# EasyEDA Pro project Quadcopter_v1.epro, schematic Quadcopter2.4
Board Name: Quadcopter2.4; Create Date: 2024-12-10; Page Name: P1; Project Name: Quadcopter; Schematic Name: Quadcopter2.4; Update Date: 2024-12-10; Address1: *; Address2: *; Address3: *; Address4: *; Application_BuildNumber: *; ApprovedBy: *; Author: *; CheckedBy: *; CompanyName: *; CurrentDate: *; CurrentTime: *; Date: *; DocumentFullPathAndName: *; DocumentName: *; DocumentNumber: *; DrawnBy: *; Engineer: *; ImagePath: *; ModifiedDate: *; Organization: *; ProjectName: *; Revision: *; Rule: *; SheetNumber: 1; SheetTotal: 1; Time: *; Title: *
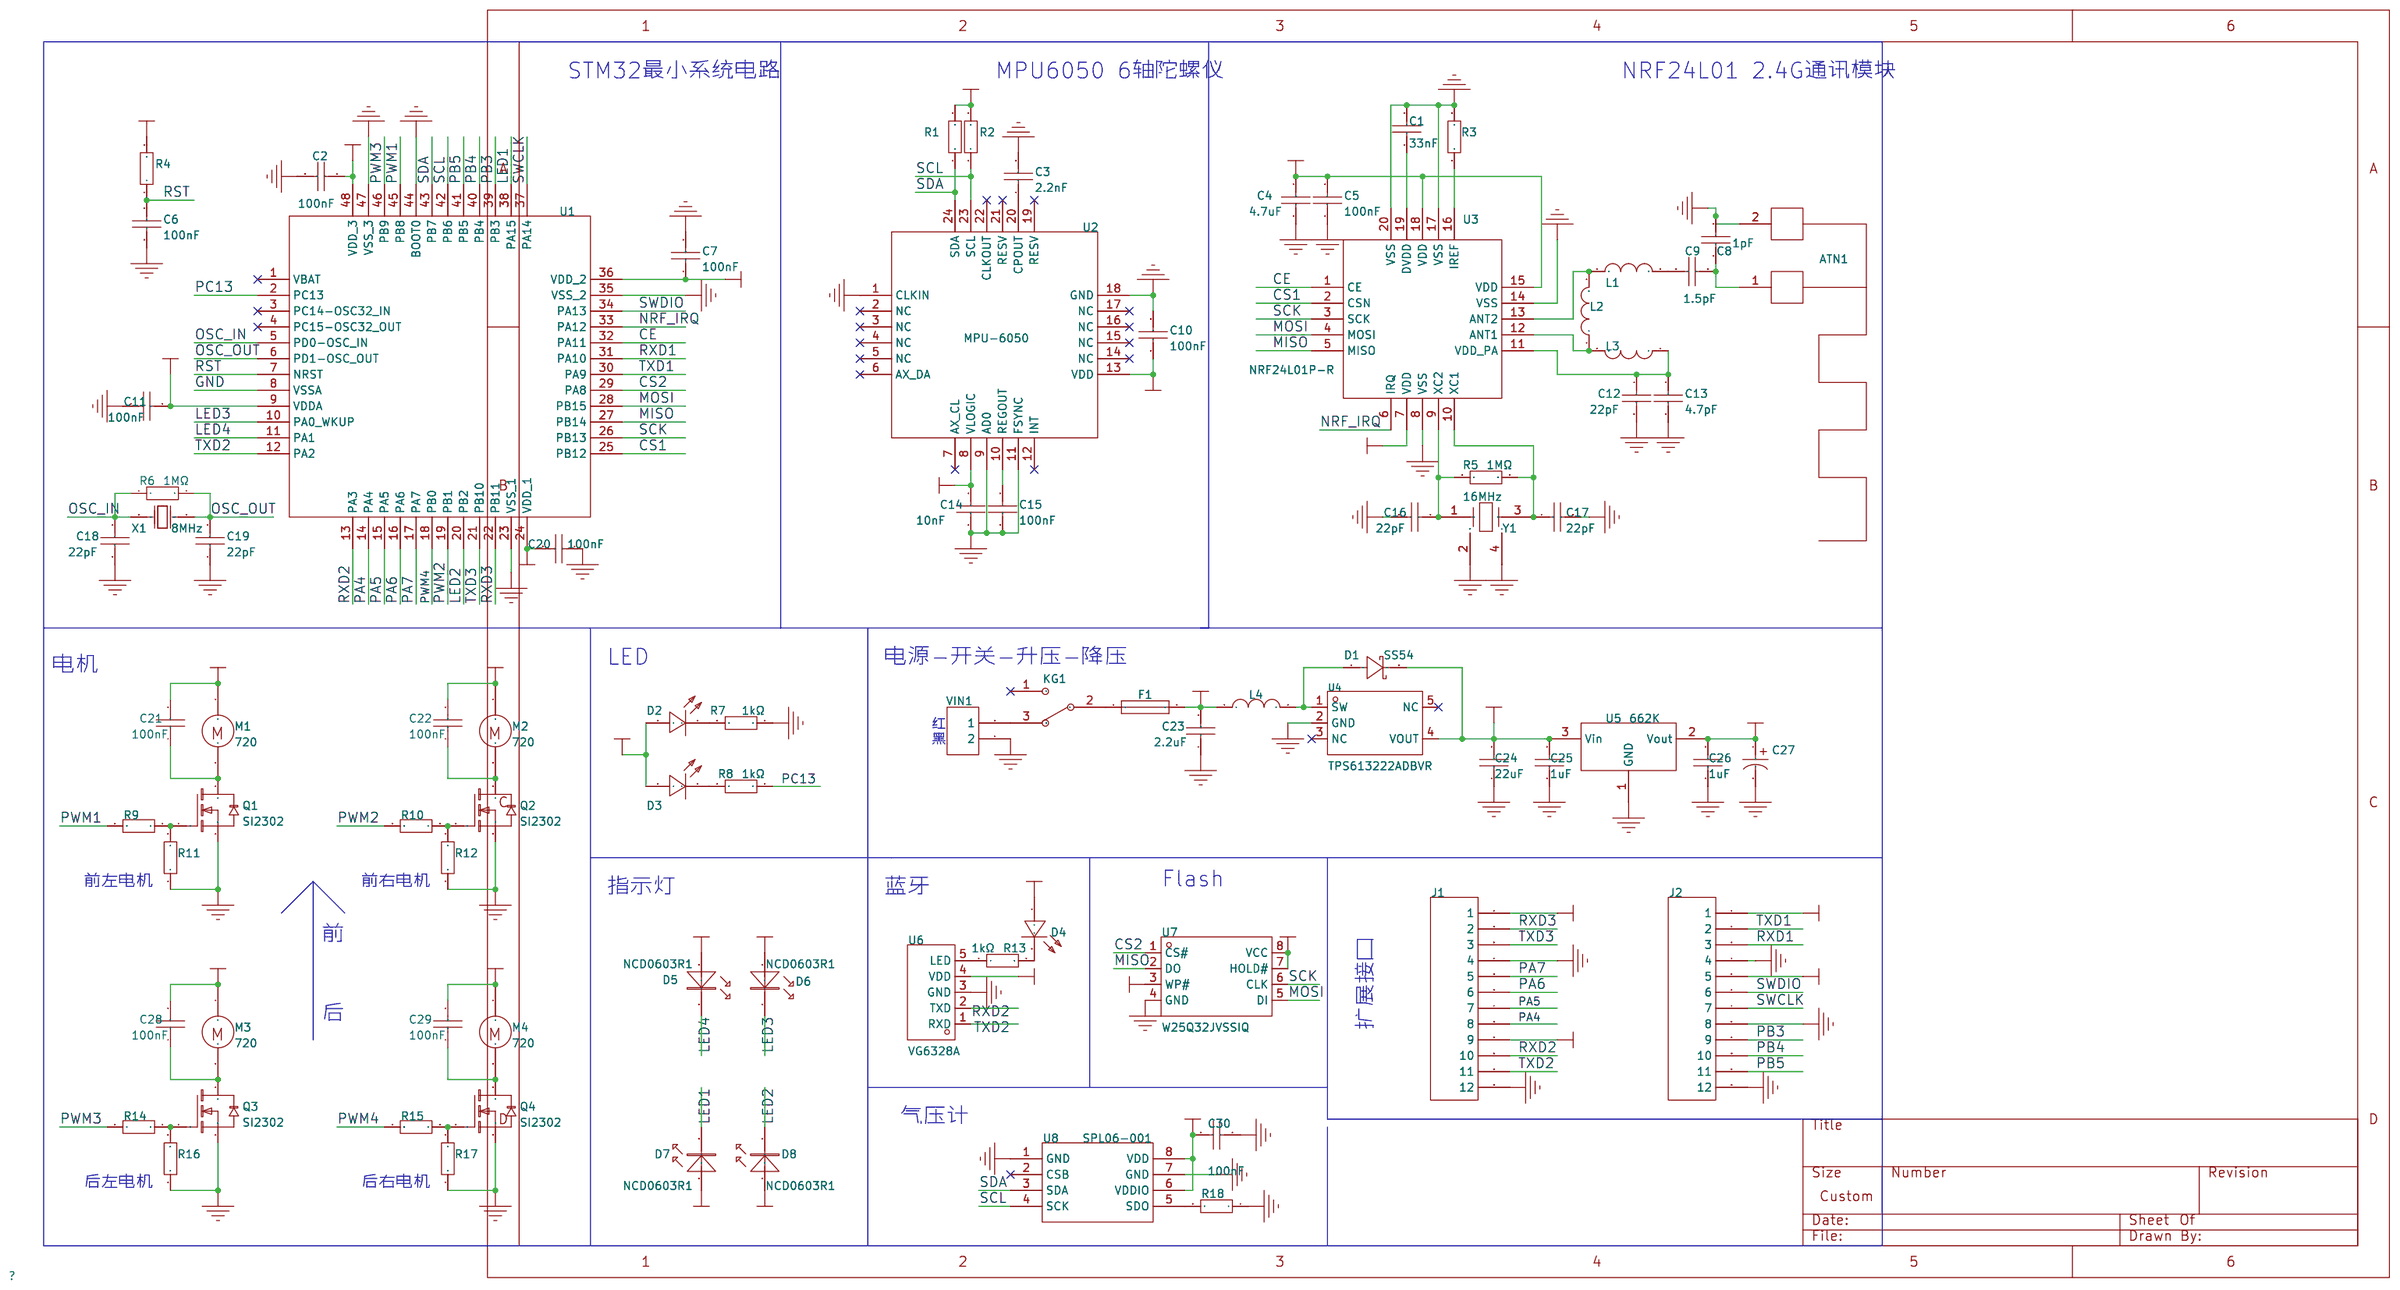
[diagram p0: schematic sheet]

## Parts
ATN1  ANT2.4G  [2.4G/ANT_2_1]
C1  33nF  [C0603]
C2  100nF  [C0603]
C3  2.2nF  [C0603]
C4  4.7uF  [C0603]
C5  100nF  [C0603]
C6  100nF  [C0603]
C7  100nF  [C0603]
C8  1pF  [C0603]
C9  1.5pF  [C0603]
C10  100nF  [C0603]
C11  100nF  [C0603]
C12  22pF  [C0603]
C13  4.7pF  [C0402]
C14  10nF  [C0603]
C15  100nF  [C0603]
C16  22pF  [C0603]
C17  22pF  [C0603]
C18  22pF  [C0603]
C19  22pF  [C0603]
C20  100nF  [C0603]
C21  100nF  [C0603]
C22  100nF  [C0603]
C23  2.2uF  [C0603]
C24  22uF  [C0603]
C25  1uF  [C0603]
C26  1uF  [C0603]
C27  47uF  [CAP-SMD_L3.2-W1.6-RD]
C28  100nF  [C0603]
C29  100nF  [C0603]
C30  100nF  [C0603]
D1  SS54  [SMA_L4.3-W2.6-LS5.0-FD]
D2  NCD0603G1  [LED0603-RD]
D3  NCD0603G1  [LED0603-RD]
D4  NCD0603G1  [LED0603-RD]
D5  NCD0603R1  [LED0603-RD_RED]
D6  NCD0603R1  [LED0603-RD_RED]
D7  NCD0603R1  [LED0603-RD_RED]
D8  NCD0603R1  [LED0603-RD_RED]
F1  BSMD0603-050-6V  [F0603]
J1  HB-PH3-254112PB2GOP  [HDR-TH_12P-P2.54-V-M]
J2  HB-PH3-254112PB2GOP  [HDR-TH_12P-P2.54-V-M]
KG1  MSK12C02  [SW-TH_MSK12C02]
L1  3.9nH  [L0603]
L2  8.2nH  [L0603]
L3  2.7nH  [L0603]
L4  2.2uH  [IND-SMD_L2.5-W2.0_MHCHL2520]
M1  720  [HDR2.54-LI-2P]
M2  720  [HDR2.54-LI-2P]
M3  720  [HDR2.54-LI-2P]
M4  720  [HDR2.54-LI-2P]
Q1  SI2302  [SOT-23-3_L2.9-W1.3-P1.90-LS2.4-BR]
Q2  SI2302  [SOT-23-3_L2.9-W1.3-P1.90-LS2.4-BR]
Q3  SI2302  [SOT-23-3_L2.9-W1.3-P1.90-LS2.4-BR]
Q4  SI2302  [SOT-23-3_L2.9-W1.3-P1.90-LS2.4-BR]
R1  10kΩ  [R0603]
R2  10kΩ  [R0603]
R3  22kΩ  [R0603]
R4  10kΩ  [R0603]
R5  1MΩ  [R0603]
R6  1MΩ  [R0603]
R7  1kΩ  [R0603]
R8  1kΩ  [R0603]
R9  1kΩ  [R0603]
R10  1kΩ  [R0603]
R11  10kΩ  [R0603]
R12  10kΩ  [R0603]
R13  1kΩ  [R0603]
R14  1kΩ  [R0603]
R15  1kΩ  [R0603]
R16  10kΩ  [R0603]
R17  10kΩ  [R0603]
R18  10kΩ  [R0603]
U1  STM32F103C8T6  [LQFP-48_L7.0-W7.0-P0.50-LS9.0-BL]
U2  MPU-6050  [QFN-24_L4.0-W4.0-P0.50-BL-EP2.7]
U3  NRF24L01P-R  [QFN-20_L4.0-W4.0-P0.50-BL-EP]
U4  TPS613222ADBVR  [TSOT-23-5_L2.9-W1.6-P0.95-LS2.8-BR]
U5  662K  [SOT-23-3_L2.9-W1.3-P1.90-LS2.4-BR]
U6  VG6328A  [COMM-SMD_VG6328A]
U7  W25Q32JVSSIQ  [SOIC-8_L5.3-W5.3-P1.27-LS8.0-BL]
U8  SPL06-001  [SENSOR-SMD_SPL06-001]
VIN1  PZ254R-11-02P  [HDR-TH_2P-P2.54-H-M-W10.4]
X1  8MHz  [CRYSTAL-SMD_L5.0-W3.2]
Y1  16MHz  [OSC-SMD_4P-L3.2-W2.5-BL]

## Library data of the parts
ATN1 = ANT2.4G: Design Item ID: ANT2.4G_2; Library Name: fly
C1 = CC0603KRX7R9BB333: 容值:33nF;精度:±10%;额定电压:50V;材质(温度系数):X7R;; LCSC Part Name: 33nF ±10% 50V; Supplier Part: C106856; Manufacturer: YAGEO(国巨); Supplier Footprint: 0603; JLCPCB Part Class: Extended Part; Datasheet: https://atta.szlcsc.com/upload/public/pdf/source/20170919/C131031_1505787245477976978.pdf; Supplier: LCSC; Tolerance: ±10%; Voltage Rated: 50V; Temperature Coefficient: X7R; Design Item ID: CAP; Library Name: fly
C2 C5-C7 C10 C11 C15 C20-C22 C28-C30 = CC0603KRX7R9BB104: 容值:100nF;精度:±10%;额定电压:50V;材质(温度系数):X7R;; LCSC Part Name: 100nF ±10% 50V; Supplier Part: C14663; Manufacturer: YAGEO(国巨); Supplier Footprint: 0603; JLCPCB Part Class: Basic Part; Datasheet: https://atta.szlcsc.com/upload/public/pdf/source/20180910/C282072_33301C7F631E79921B82A8DAC6BCC5B3.pdf; Supplier: LCSC; Tolerance: ±10%; Voltage Rated: 50V; Temperature Coefficient: X7R; Design Item ID: CAP; Library Name: fly
C3 = CC0603KRX7R9BB222: 容值:2.2nF;精度:±10%;额定电压:50V;材质(温度系数):X7R;; LCSC Part Name: 2.2nF ±10% 50V; Supplier Part: C107082; Manufacturer: YAGEO(国巨); Supplier Footprint: 0603; JLCPCB Part Class: Extended Part; Datasheet: https://atta.szlcsc.com/upload/public/pdf/source/20180910/C282072_33301C7F631E79921B82A8DAC6BCC5B3.pdf; Supplier: LCSC; Tolerance: ±10%; Voltage Rated: 50V; Temperature Coefficient: X7R; Design Item ID: CAP; Library Name: fly
C4 = CL10A475KP8NNNC: 容值:4.7uF;精度:±10%;额定电压:10V;材质(温度系数):X5R;; LCSC Part Name: 4.7uF ±10% 10V; Supplier Part: C1705; Manufacturer: SAMSUNG(三星); Supplier Footprint: 0603; JLCPCB Part Class: Extended Part; Datasheet: https://atta.szlcsc.com/upload/public/pdf/source/20160218/1457707763339.pdf; Supplier: LCSC; Tolerance: ±10%; Voltage Rated: 10V; Temperature Coefficient: X5R; Design Item ID: CAP; Library Name: fly
C8 = CC0603BRNPO9BN1R0: 容值:1pF;额定电压:50V;材质(温度系数):NP0;; LCSC Part Name: 1pF 50V; Supplier Part: C115062; Manufacturer: YAGEO(国巨); Supplier Footprint: 0603; JLCPCB Part Class: Extended Part; Datasheet: https://atta.szlcsc.com/upload/public/pdf/source/20200715/C115062_568EBB839DD5FCCCFFFD9B399C98B320.pdf; Supplier: LCSC; Voltage Rated: 50V; Temperature Coefficient: NP0; Design Item ID: CAP; Library Name: fly
C9 = CC0603BRNPO9BN1R5: 容值:1.5pF;额定电压:50V;材质(温度系数):NP0;; LCSC Part Name: 1.5pF 50V; Supplier Part: C519100; Manufacturer: YAGEO(国巨); Supplier Footprint: 0603; JLCPCB Part Class: Extended Part; Datasheet: https://atta.szlcsc.com/upload/public/pdf/source/20200423/C519100_590EDC9A5984E9A1EB7B6CD778FC3C5B.pdf; Supplier: LCSC; Voltage Rated: 50V; Temperature Coefficient: NP0; Tolerance: ±5%; Design Item ID: CAP; Library Name: fly
C12 C16-C19 = CC0603JRNPO9BN220: 容值:22pF;精度:±5%;额定电压:50V;材质(温度系数):NP0;; LCSC Part Name: 22pF ±5% 50V; Supplier Part: C105620; Manufacturer: YAGEO(国巨); Supplier Footprint: 0603; JLCPCB Part Class: Extended Part; Datasheet: https://atta.szlcsc.com/upload/public/pdf/source/20170505/1493957838062.pdf; Supplier: LCSC; Tolerance: ±5%; Voltage Rated: 50V; Temperature Coefficient: NP0; Design Item ID: CAP; Library Name: fly
C13 = CC0402BRNPO9BN4R7: 容值:4.7pF;额定电压:50V;材质(温度系数):NP0;; LCSC Part Name: 4.7pF 50V; Supplier Part: C325453; Manufacturer: YAGEO(国巨); Supplier Footprint: 0402; JLCPCB Part Class: Extended Part; Datasheet: https://atta.szlcsc.com/upload/public/pdf/source/20181031/C325453_FE7FAD6962257328986AFAE1D40136CC.pdf; Supplier: LCSC; Voltage Rated: 50V; Temperature Coefficient: NP0; Tolerance: ±10%; Design Item ID: CAP; Library Name: fly
C14 = CC0603KRX7R9BB103: 容值:10nF;精度:±10%;额定电压:50V;材质(温度系数):X7R;; LCSC Part Name: 10nF ±10% 50V; Supplier Part: C100042; Manufacturer: YAGEO(国巨); Supplier Footprint: 0603; JLCPCB Part Class: Extended Part; Datasheet: https://atta.szlcsc.com/upload/public/pdf/source/20181008/C309510_22F155564471FAF6A489F7D68F34234E.pdf; Supplier: LCSC; Tolerance: ±10%; Voltage Rated: 50V; Temperature Coefficient: X7R; Design Item ID: CAP; Library Name: fly
C23 = CL10A225KO8NNNC: 容值:2.2uF;精度:±10%;额定电压:16V;材质(温度系数):X5R;; LCSC Part Name: 2.2uF ±10% 16V; Supplier Part: C23630; Manufacturer: SAMSUNG(三星); Supplier Footprint: 0603; JLCPCB Part Class: Basic Part; Datasheet: https://atta.szlcsc.com/upload/public/pdf/source/20160218/1457707763339.pdf; Supplier: LCSC; Tolerance: ±10%; Voltage Rated: 16V; Temperature Coefficient: X5R; Design Item ID: CAP; Library Name: fly
C24 = CL10A226MQ8NRNC: 容值:22uF;精度:±20%;额定电压:6.3V;材质(温度系数):X5R;; LCSC Part Name: 22uF ±20% 6.3V; Supplier Part: C59461; Manufacturer: SAMSUNG(三星); Supplier Footprint: 0603; JLCPCB Part Class: Basic Part; Datasheet: https://atta.szlcsc.com/upload/public/pdf/source/20160218/1457707763339.pdf; Supplier: LCSC; Tolerance: ±20%; Voltage Rated: 6.3V; Temperature Coefficient: X5R; Design Item ID: CAP; Library Name: fly
C25 C26 = CL10A105KO8NNNC: 容值:1uF;精度:±10%;额定电压:16V;材质(温度系数):X5R;; LCSC Part Name: 1uF ±10% 16V; Supplier Part: C1592; Manufacturer: SAMSUNG(三星); Supplier Footprint: 0603; JLCPCB Part Class: Extended Part; Datasheet: https://atta.szlcsc.com/upload/public/pdf/source/20220919/9FBE606BE0D9532D730F292EB26DC5BB.pdf; Supplier: LCSC; Tolerance: ±10%; Voltage Rated: 16V; Temperature Coefficient: X5R; Design Item ID: CAP; Library Name: fly
C27 = TC212A476K006Y: 容值:47uF;精度:±10%;额定电压:6.3V;等效串联电阻:2.5Ω@100kHz;; LCSC Part Name: 47uF ±10% 6.3V; Supplier Part: C108525; Manufacturer: Sunlord(顺络); Supplier Footprint: CASE-A-3216-18(mm); JLCPCB Part Class: Extended Part; Datasheet: https://atta.szlcsc.com/upload/public/pdf/source/20231030/DDA5D10C6B7FCAF98AC7C23C2BD0B0CB.pdf; Supplier: LCSC; Tolerance: ±10%; Rated Voltage: 6.3V; Equivalent Series Resistance(ESR): 2.5Ω@100kHz; Operating Temperature: -55℃~+125℃; Voltage Rated: 6.3V; Temperature Coefficient: X5R; Design Item ID: Cap Pol; Library Name: fly; Published: 8-Jun-2000; LatestRevisionDate: 17-Jul-2002; LatestRevisionNote: Re-released for DXP Platform.; PackageReference: RB7.6-15; Publisher: Altium Limited; PackageDescription: Polarized Capacitor (Radial); 2 Leads
D1 = SS54_C7420369: 二极管配置:独立式;正向压降(Vf):550mV@5.0A;直流反向耐压(Vr):40V;平均整流电流(Io):5A;; LCSC Part Name: 电压:40V 电流:5A; Supplier Part: C7420369; Manufacturer: 宏迦橙; Supplier Footprint: SMA(DO-214AC); JLCPCB Part Class: 扩展库; Datasheet: https://atta.szlcsc.com/upload/public/pdf/source/20230828/254C3882F8647358AD9F60DD73611B5E.pdf; Supplier: LCSC; Diode Configuration: 独立式; Forward Voltage (Vf@If): 550mV@5.0A; Reverse Voltage (Vr): 40V; Average Rectified Current (Io): 5A; Reverse Leakage Current (Ir): 50uA@40V; Peak forward surge current: 120A
D2-D4 = NCD0603G1: 发光颜色:翠绿色;正向电压(VF):2.6V~3.6V;功率:72mW;正向电流:10mA;主波长:515nm~530nm;透镜颜色:无色透明透镜;发光强度:330mcd~900mcd;发光角度:130°;工作温度:-30℃~+85℃;; Supplier Part: C84267; Manufacturer: 国星光电; Supplier Footprint: 0603; JLCPCB Part Class: Extended Part; Datasheet: https://atta.szlcsc.com/upload/public/pdf/source/20200820/C84267_04BA7703640BAC111D09F5EFB971FBF3.pdf; Supplier: LCSC; Emitted Color: 翠绿色; Forward Voltage (VF): 2.6V~3.6V; Power Dissipation: 72mW; Forward Current: 10mA; Dominant Wavelength: 515nm~530nm; Lens Color: 无色透明透镜; Luminous Intensity: 330mcd~900mcd; Viewing Angle: 130°; Operating Temperature: -30℃~+85℃; Diode Configuration: 独立二极管; Origin Footprint 1: 204-10SURD/S530-A3; Origin Footprint 2: LED0805-RD
D5-D8 = NCD0603R1_C84263: 灯头类型:-;发光颜色:红色;正向电压(VF):1.6V~2.6V;功率:65mW;正向电流:20mA;主波长:615nm~630nm;二极管配置:独立二极管;透镜颜色:无色透明透镜;色温:-;发光强度:80mcd~220mcd;发光角度:130°;载带方式:-;工作温度:-30℃~+85℃;; Supplier Part: C84263; Manufacturer: 国星光电; Supplier Footprint: 0603; JLCPCB Part Class: Extended Part; Datasheet: https://atta.szlcsc.com/upload/public/pdf/source/20200820/C84263_DABC6A75E58F576973B407FDBA283D60.pdf; Supplier: LCSC; Emitted Color: 红色; Forward Voltage (VF): 1.6V~2.6V; Power Dissipation: 65mW; Forward Current: 20mA; Dominant Wavelength: 615nm~630nm; Diode Configuration: 独立二极管; Lens Color: 无色透明透镜; Luminous Intensity: 80mcd~220mcd; Viewing Angle: 130°; Operating Temperature: -30℃~+85℃; Design Item ID: LED; Library Name: fly
F1 = BSMD0603-050-6V: 最大电压:6V;最大电流:40A;保持电流:500mA;跳闸电流:1A;; LCSC Part Name: 6V 500mA 0603自恢复; Supplier Part: C883095; Manufacturer: BHFUSE(佰宏); Supplier Footprint: 0603; JLCPCB Part Class: Extended Part; Datasheet: https://atta.szlcsc.com/upload/public/pdf/source/20230512/E478DE3555A0061DA0124A9F45802B86.pdf; Supplier: LCSC; Operating Voltage (Max): 6V; Current Rating (Max): 40A; Hold Current: 500mA; Trip Current: 1A; Power Dissipation: 500mW; Resistance - Initial (Ri) (Min): 100mΩ; Resistance - Post Trip (R1) (Max): 800mΩ; Maximum Time to Trip: 100ms; Operating Temperature: -40℃~+85℃; Design Item ID: FUSE1; Library Name: fly
J1 J2 = HB-PH3-254112PB2GOP: 插针结构:1x12P;间距:2.54mm;行距:2.54mm;圆针/方针:方针;安装类型:直插;排数:单排;总PIN位数:12P;额定电流:3A;额定电压:250V;配合针长度:6mm;塑高:2.54mm;端接针长度:3mm;触头材质:黄铜;触头镀层:金;工作温度范围:-40℃~+105℃;焊接温度(最大值):260℃;颜色:黑色;; LCSC Part Name: 间距:2.54mm 1x12P 直插 方针; Supplier Part: C6332195; Manufacturer: HANBO(汉博); Supplier Footprint: 插件,P=2.54mm; JLCPCB Part Class: Extended Part; Datasheet: https://atta.szlcsc.com/upload/public/pdf/source/20230803/F72D259687963761DF1B552F3BB84A31.pdf; Supplier: LCSC; Pin Structure: 1x12P; Pitch: 2.54mm; Row Spacing: 2.54mm; Circluar Pins/Square Pins: 方针; Mounting Type: 直插; Number of Rows: 单排; Number of Pins: 12P; Current Rating (Max): 3A; Voltage Rating (Max): 250V; Length of Mating Pin: 6mm; Insulation Height: 2.54mm; Length of End Connection Pin: 3mm; Contact Material: 黄铜; Contact Plating: 金; Operating Temperature Range: -40℃~+105℃; Soldering Temperature(Max): 260℃; Color: 黑色; Design Item ID: Header 12; Library Name: fly; LatestRevisionDate: 17-Jul-2002; LatestRevisionNote: Re-released for DXP Platform.; Publisher: Altium Limited
KG1 = MSK12C02: 电路结构:单刀双掷;安装方式:卧贴;开关颜色:-;额定电流(DC):50mA;额定电压(DC):12V;额定电流(AC):-;额定电压(AC):-;机械寿命:1万次;; LCSC Part Name: 两档侧拨贴片 7脚 滑动开关; Supplier Part: C431540; Manufacturer: SHOU HAN(首韩); Supplier Footprint: SMD; JLCPCB Part Class: Extended Part; Datasheet: https://atta.szlcsc.com/upload/public/pdf/source/20190925/C431540_89155AEF0758B9AD1B2D805F83FB12E3.pdf; Supplier: LCSC; Circuit: 单刀双掷; Pin Style: SMD接片; Switch Length: 8mm; Switch Width: 2.8mm; Switch Height: 1.4mm; Mounting Style: 卧贴; Current Rating (DC): 50mA; Voltage Rating (DC): 12V; Mechanical Life: 1万次; Operating Temperature: -20℃~+70℃; Design Item ID: SW-SPDT; Library Name: fly; Published: 24-Mar-1999; LatestRevisionDate: 17-Dec-2003; LatestRevisionNote: Schematic revised, PCB Footprint replaced.; DatasheetVersion: 05-Dec-2000; PackageReference: TL36WW15050; Publisher: Altium Limited; PackageDescription: Switch; 4 Leads; ComponentLink1Description: Manufacturer Link; ComponentLink1URL: http://www.apem.com
L1 = SCC1608C3N9SSP: 电感值:3.9nH;额定电流:500mA;饱和电流(Isat):-;直流电阻(DCR):200mΩ;; Supplier Part: C412029; Manufacturer: Sunltech(韩国顺磁); Supplier Footprint: 0603; JLCPCB Part Class: Extended Part; Datasheet: https://atta.szlcsc.com/upload/public/pdf/source/20190819/C412052_7E47CA9107AD18C13168C896A90007C8.pdf; Supplier: LCSC; Rated Current: 500mA; DC Resistance (DCR): 200mΩ; Design Item ID: Inductor Chip; Library Name: fly; Published: 8-Jun-2000; Revision: July-2002: Re-released for DXP Platform.; Publisher: Altium Limited
L2 = SCC1608C8N2JSP: 电感值:8.2nH;精度:±5%;额定电流:500mA;饱和电流(Isat):-;直流电阻(DCR):300mΩ;; LCSC Part Name: 8.2nH ±5%; Supplier Part: C412032; Manufacturer: Sunltech(韩国顺磁); Supplier Footprint: 0603; JLCPCB Part Class: Extended Part; Datasheet: https://atta.szlcsc.com/upload/public/pdf/source/20190819/C412052_7E47CA9107AD18C13168C896A90007C8.pdf; Supplier: LCSC; Tolerance: ±5%; Rated Current: 500mA; DC Resistance (DCR): 300mΩ; Design Item ID: Inductor Chip; Library Name: fly; Published: 8-Jun-2000; Revision: July-2002: Re-released for DXP Platform.; Publisher: Altium Limited
L3 = SCC1608C2N7SSP: 电感值:2.7nH;额定电流:500mA;饱和电流(Isat):-;直流电阻(DCR):200mΩ;; Supplier Part: C412027; Manufacturer: Sunltech(韩国顺磁); Supplier Footprint: 0603; JLCPCB Part Class: Extended Part; Datasheet: https://atta.szlcsc.com/upload/public/pdf/source/20190819/C412052_7E47CA9107AD18C13168C896A90007C8.pdf; Supplier: LCSC; Rated Current: 500mA; DC Resistance (DCR): 200mΩ; Design Item ID: Inductor Chip; Library Name: fly; Published: 8-Jun-2000; Revision: July-2002: Re-released for DXP Platform.; Publisher: Altium Limited
L4 = FTC252012S2R2MBCA: 电感值:2.2uH;精度:±20%;额定电流:3A;饱和电流(Isat):3.8A;类型:一体成型电感;; LCSC Part Name: 2.2uH ±20% 3.8A; Supplier Part: C5832372; Manufacturer: cjiang(长江微电); Supplier Footprint: 1008; JLCPCB Part Class: Extended Part; Datasheet: https://atta.szlcsc.com/upload/public/pdf/source/20230602/8FFEDA9C0247A92A0D4B67554BFE4091.pdf; Supplier: LCSC; Tolerance: ±20%; Rated Current: 3A; Saturation Current (Isat): 3.8A; DC Resistance (DCR): 55mΩ; Type: 一体成型电感; Q @ Freq: 35@10MHz; Frequency - Self Resonant: 75MHz; Design Item ID: Inductor Chip; Library Name: fly; Published: 8-Jun-2000; Revision: July-2002: Re-released for DXP Platform.; Publisher: Altium Limited
M1-M4 = 720: Motor, General Kind; Published: 24-Mar-1999; LatestRevisionDate: 17-Jul-2002; LatestRevisionNote: Re-released for DXP Platform.; PackageReference: RB5-10.5; Publisher: Altium Limited; PackageDescription: Capacitor (Radial); 2 Leads; Design Item ID: Motor; Library Name: fly
Q1-Q4 = SI2302_C2891732: 类型:N沟道;漏源电压(Vdss):20V;连续漏极电流(Id):3A;功率(Pd):1W;导通电阻(RDS(on)@Vgs,Id):50mΩ@4.5V,3A;阈值电压(Vgs(th)@Id):1V@250uA;; LCSC Part Name: N沟道 耐压:20V 电流:3A; Supplier Part: C2891732; Manufacturer: YONGYUTAI(永裕泰); Supplier Footprint: SOT-23; JLCPCB Part Class: Extended Part; Datasheet: https://atta.szlcsc.com/upload/public/pdf/source/20210901/467BBA277A18343FF82D7D641AA41F7C.pdf; Supplier: LCSC; Type: N沟道; Drain Source Voltage (Vdss): 20V; Continuous Drain Current (Id): 3A; Power Dissipation (Pd): 1W; Drain Source On Resistance (RDS(on)@Vgs,Id): 50mΩ@4.5V,3A; Gate Threshold Voltage (Vgs(th)@Id): 1V@250uA; Input Capacitance (Ciss@Vds): 300pF@10V; Reverse Transfer Capacitance (Crss@Vds): 80pF@10V; Design Item ID: N_MOS; Library Name: fly
R1 R2 R11 R12 R16-R18 = RC0603FR-0710KL: 电阻类型:厚膜电阻;阻值:10kΩ;精度:±1%;功率:100mW;最大工作电压:75V;温度系数:±100ppm/℃;; LCSC Part Name: 厚膜电阻 10kΩ ±1% 100mW; Supplier Part: C98220; Manufacturer: YAGEO(国巨); Supplier Footprint: 0603; JLCPCB Part Class: Extended Part; Datasheet: https://atta.szlcsc.com/upload/public/pdf/source/20180927/C295883_E8D83085EA81BD7DE0B2B681138C15EE.pdf; Supplier: LCSC; Type: 厚膜电阻; Tolerance: ±1%; Power(Watts): 100mW; Overload Voltage (Max): 75V; Temperature Coefficient: ±100ppm/℃; Operating Temperature Range: -55℃~+155℃; Design Item ID: Res2; Library Name: fly; Published: 8-Jun-2000; LatestRevisionDate: 17-Jul-2002; LatestRevisionNote: Re-released for DXP Platform.; Publisher: Altium Limited
R3 = RC0603FR-0722KL: 电阻类型:厚膜电阻;阻值:22kΩ;精度:±1%;功率:100mW;最大工作电压:75V;温度系数:±100ppm/℃;; LCSC Part Name: 厚膜电阻 22kΩ ±1% 100mW; Supplier Part: C114065; Manufacturer: YAGEO(国巨); Supplier Footprint: 0603; JLCPCB Part Class: Extended Part; Datasheet: https://atta.szlcsc.com/upload/public/pdf/source/20180316/70C0E2BDAE7FCC62C531A5A58D202EE1.pdf; Supplier: LCSC; Type: 厚膜电阻; Tolerance: ±1%; Power(Watts): 100mW; Overload Voltage (Max): 75V; Temperature Coefficient: ±100ppm/℃; Operating Temperature Range: -55℃~+155℃; Design Item ID: Res2; Library Name: fly; Published: 8-Jun-2000; LatestRevisionDate: 17-Jul-2002; LatestRevisionNote: Re-released for DXP Platform.; Publisher: Altium Limited
R4 = RC0603FR-0710KL: 电阻类型:厚膜电阻;阻值:10kΩ;精度:±1%;功率:100mW;最大工作电压:75V;温度系数:±100ppm/℃;; LCSC Part Name: 厚膜电阻 10kΩ ±1% 100mW; Supplier Part: C98220; Manufacturer: YAGEO(国巨); Supplier Footprint: 0603; JLCPCB Part Class: Extended Part; Datasheet: https://atta.szlcsc.com/upload/public/pdf/source/20180927/C295883_E8D83085EA81BD7DE0B2B681138C15EE.pdf; Supplier: LCSC; Type: 厚膜电阻; Tolerance: ±1%; Power(Watts): 100mW; Overload Voltage (Max): 75V; Temperature Coefficient: ±100ppm/℃; Operating Temperature Range: -55℃~+155℃; Origin Footprint 1: R_0603; Design Item ID: Res2; Library Name: fly; Published: 8-Jun-2000; LatestRevisionDate: 17-Jul-2002; LatestRevisionNote: Re-released for DXP Platform.; Publisher: Altium Limited
R5 R6 = 0603WAF1004T5E: 电阻类型:厚膜电阻;阻值:1MΩ;精度:±1%;功率:100mW;最大工作电压:75V;温度系数:±100ppm/℃;; LCSC Part Name: 1MΩ ±1% 100mW 厚膜电阻; Supplier Part: C22935; Manufacturer: UNI-ROYAL(厚声); Supplier Footprint: 0603; JLCPCB Part Class: Basic Part; Datasheet: https://atta.szlcsc.com/upload/public/pdf/source/20200306/C422600_1E6D84923E4A46A82E41ADD87F860B5C.pdf; Supplier: LCSC; Type: 厚膜电阻; Tolerance: ±1%; Power(Watts): 100mW; Overload Voltage (Max): 75V; Temperature Coefficient: ±100ppm/℃; Operating Temperature Range: -55℃~+155℃
R7 R8 R13 = RC0603FR-071KL: 电阻类型:厚膜电阻;阻值:1kΩ;精度:±1%;功率:100mW;最大工作电压:75V;温度系数:±100ppm/℃;; LCSC Part Name: 厚膜电阻 1kΩ ±1% 100mW; Supplier Part: C22548; Manufacturer: YAGEO(国巨); Supplier Footprint: 0603; JLCPCB Part Class: Extended Part; Datasheet: https://atta.szlcsc.com/upload/public/pdf/source/20180316/70C0E2BDAE7FCC62C531A5A58D202EE1.pdf; Supplier: LCSC; Type: 厚膜电阻; Tolerance: ±1%; Power(Watts): 100mW; Overload Voltage (Max): 75V; Temperature Coefficient: ±100ppm/℃; Operating Temperature Range: -55℃~+155℃
R9 R10 R14 R15 = RC0603FR-071KL: 电阻类型:厚膜电阻;阻值:1kΩ;精度:±1%;功率:100mW;最大工作电压:75V;温度系数:±100ppm/℃;; LCSC Part Name: 厚膜电阻 1kΩ ±1% 100mW; Supplier Part: C22548; Manufacturer: YAGEO(国巨); Supplier Footprint: 0603; JLCPCB Part Class: Extended Part; Datasheet: https://atta.szlcsc.com/upload/public/pdf/source/20180316/70C0E2BDAE7FCC62C531A5A58D202EE1.pdf; Supplier: LCSC; Type: 厚膜电阻; Tolerance: ±1%; Power(Watts): 100mW; Overload Voltage (Max): 75V; Temperature Coefficient: ±100ppm/℃; Operating Temperature Range: -55℃~+155℃; Design Item ID: Res2; Library Name: fly; Published: 8-Jun-2000; LatestRevisionDate: 17-Jul-2002; LatestRevisionNote: Re-released for DXP Platform.; Publisher: Altium Limited
U1 = STM32F103C8T6: CPU内核:ARM-M3;程序存储容量:64KB;RAM总容量:20KB;GPIO端口数量:37;工作电压范围:2V~3.6V;CPU最大主频:72MHz;程序存储器类型:FLASH;; LCSC Part Name: 主流增强型ARM Cortex-M3 MCU，具有64 KB Flash、72 MHz CPU、电机控制、USB和CAN; Supplier Part: C8734; Manufacturer: ST(意法半导体); Supplier Footprint: LQFP-48(7x7); JLCPCB Part Class: Extended Part; Datasheet: https://atta.szlcsc.com/upload/public/pdf/source/20220812/8363ACEC51AD55ECEB84799464F7CB85.pdf; Supplier: LCSC; CPU Core: ARM-M3; Program Storage Size: 64KB; RAM Size: 20KB; GPIO Ports Number: 37; Operating Voltage Range: 2V~3.6V; CPU Maximum Speed: 72MHz; Program Memory Type: FLASH; Operating Temperature Range: -40℃~+85℃; ADC (Bit): 12bit; Universal Serial Bus: 有; Peripheral/Function: 看门狗；DMA；看门狗；温度传感器; Watchdog: 有; Infrared Data Association: 有; Low-Voltage Detect: 有; Direct Memory Access: 有; Internal Oscillator: 有; Design Item ID: STM32_LQFP48; Library Name: fly
U2 = MPU-6050: 传感器类型:加速度计陀螺仪;; Supplier Part: C24112; Manufacturer: TDK InvenSense(应美盛); Supplier Footprint: QFN-24-EP(4x4); JLCPCB Part Class: Extended Part; Datasheet: https://atta.szlcsc.com/upload/public/pdf/source/20140425/1457707046159.pdf; Supplier: LCSC; Sensor Type: 加速度计陀螺仪; Operating Temperature: -40℃~+85℃; Design Item ID: MPU6050; Library Name: fly
U3 = NRF24L01P-R: 频率范围:2.4GHz;接口:SPI;应用领域:通用 ISM>1GHz;数据速率:2Mbps;灵敏度:-94dBm;典型应用频率:2.4GHz;; LCSC Part Name: 单芯片2.4GHz收发器; Supplier Part: C8791; Manufacturer: NORDIC; Supplier Footprint: QFN-20-EP(4x4); JLCPCB Part Class: Extended Part; Datasheet: https://atta.szlcsc.com/upload/public/pdf/source/20120816/1457706530106.pdf; Supplier: LCSC; Frequency Range: 2.4GHz; Interface: SPI; Operating Voltage: 1.9V~3.6V; Applications: 通用 ISM>1GHz; Output Power: 0dBm; Data Rate: 2Mbps; Current Of Transmitting: 7mA; Sensitivity: -94dBm; Receive Current: 12.6mA; Typical Application Frequency: 2.4GHz; Operating Temperature: -40℃~+85℃; Design Item ID: NRF24L01; Library Name: fly
U4 = TPS613222ADBVR: 功能类型:升压型;输出类型:固定;输入电压:900mV~5.5V;输出电压:5V;输出电流(最大值):2.5A;; Supplier Part: C2071163; Manufacturer: TI(德州仪器); Supplier Footprint: SOT-23-5; JLCPCB Part Class: 扩展库; Datasheet: https://www.ti.com/cn/lit/gpn/tps61322; Supplier: LCSC; Function: 升压型; Output Type: 固定; Input Voltage: 900mV~5.5V; Output Voltage: 5V; Output Current (Max): 2.5A; Switching Frequency: 2MHz; Operating Temperature: -40℃~+125℃@(TJ); Synchronous Rectification: 是; Number of Outputs: 1; Topology: 升压式; Switch tube (built-in/external): 内置
U5 = 662K: 输出类型:固定;最大输入电压:8V;输出电压:3.3V;最大输出电流:300mA;输出极性:正极;; LCSC Part Name: 662K. 输入8V 300mA; Supplier Part: C7470756; Manufacturer: HXY MOSFET(华轩阳电子); Supplier Footprint: SOT-23; JLCPCB Part Class: Extended Part; Datasheet: https://atta.szlcsc.com/upload/public/pdf/source/20230915/BA72989D17401E2852D389BF12EDF43F.pdf; Supplier: LCSC; Output Type: 固定; Maximum Input Voltage: 8V; Output Voltage: 3.3V; MAX Output Current: 300mA; Output Polarity: 正极; Number of Outputs: 1; Design Item ID: LM317; Library Name: fly
U6 = VG6328A: VG6328A 蓝牙透传是一款从机蓝牙透传模块。 / AT 指令模式：用户可以通过相应指令集对模块的参数进行查询或配置。 / 串口默认参数： 波特率(115200 baud)， 8个数据位， 1个停止位， 无奇偶校验位。 / 串口向模块发的数据包一包不要超过255个字节，否则会溢出导致数据出错。 / APP向模块发的数据包一包不要超过4096个字节。 / 广播间隔：100MS。 / 支持 AT 模式： 用户也可以通过串口AT 指令，对模块支持的参数进行修改 / （例如： 串口波特率、蓝牙设备名等）。 / 支持透传模式： 用户可以通过模; LCSC Part Name: 6328A低成本串口蓝牙模块; Supplier Part: C20539408; Manufacturer: Vollgo(沃进); Supplier Footprint: SMD,16x13.6mm; JLCPCB Part Class: 扩展库; Datasheet: https://atta.szlcsc.com/upload/public/pdf/source/20240112/5EEE1D6A89302B67E38E5FC88F83A793.pdf; Supplier: LCSC
U7 = W25Q32JVSSIQ: Supplier Part: C179173; Manufacturer: WINBOND(华邦); Supplier Footprint: SOIC-8-208mil; JLCPCB Part Class: 扩展库; Datasheet: https://atta.szlcsc.com/upload/public/pdf/source/20191218/C179173_5BBD793D2D7B3672E140BC7AE85C11FF.pdf; Supplier: LCSC
U8 = SPL06-001_C2684428: LCSC Part Name: 普通气压传感器 停产; Supplier Part: C2684428; Manufacturer: Goertek(歌尔); Supplier Footprint: LGA-8(2x2.5); JLCPCB Part Class: Extended Part; Datasheet: https://atta.szlcsc.com/upload/public/pdf/source/20210120/C2684428_7EA58BBCA3793458F617124FBE4BF8F1.pdf; Supplier: LCSC; Operating Temperature: -40℃~+85℃; Design Item ID: SPL06; Library Name: fly
VIN1 = PZ254R-11-02P: 插针结构:1x2P;间距:2.54mm;行距:-;圆针/方针:方针;安装类型:弯插;排数:单排;总PIN位数:2P;额定电流:-;额定电压:-;配合针长度:6mm;塑高:2.5mm;触头材质:黄铜;触头镀层:-;工作温度范围:-40℃~+105℃;颜色:黑色;; LCSC Part Name: 间距:2.54mm 1x2P 弯插 方针; Supplier Part: C492410; Manufacturer: XFCN(兴飞); Supplier Footprint: 弯插,P=2.54mm; JLCPCB Part Class: Extended Part; Datasheet: https://atta.szlcsc.com/upload/public/pdf/source/20200309/C492410_AD20A982E51A4870F6FD4D2413672598.pdf; Supplier: LCSC; Pin Structure: 1x2P; Pitch: 2.54mm; Circluar Pins/Square Pins: 方针; Mounting Type: 弯插; Number of Rows: 单排; Number of Pins: 2P; Length of Mating Pin: 6mm; Insulation Height: 2.5mm; Contact Material: 黄铜; Operating Temperature Range: -40℃~+105℃; Color: 黑色; Design Item ID: CON2; Library Name: fly
X1 = X50328MSB2GI: 晶振类型:贴片晶振;频率:8MHz;常温频差:±10ppm;外接负载电容:20pF;频率稳定度(全温):±20ppm;; LCSC Part Name: 8MHz ±10ppm 20pF YSX530GA; Supplier Part: C115962; Manufacturer: YXC(扬兴晶振); Supplier Footprint: SMD5032; JLCPCB Part Class: Basic Part; Datasheet: https://atta.szlcsc.com/upload/public/pdf/source/20240329/44922B0AF7B60E58E9B66993B6077277.pdf; Supplier: LCSC; Crystal Type: 贴片晶振; Normal temperature Frequency Tolerance: ±10ppm; External load capacitor: 20pF; Frequency Stability(Full temperature range): ±20ppm; Operating Temperature: -40℃~+85℃; Origin Footprint 2: HC-49-SMD_L7.0-W3.0
Y1 = X322516MLB4SI: 晶振类型:贴片晶振;频率:16MHz;常温频差:±10ppm;外接负载电容:9pF;频率稳定度(全温):±20ppm;; LCSC Part Name: 16MHz ±10ppm 9pF; Supplier Part: C13738; Manufacturer: YXC(扬兴晶振); Supplier Footprint: SMD3225-4P; JLCPCB Part Class: Basic Part; Datasheet: https://atta.szlcsc.com/upload/public/pdf/source/20240329/19D5F850207469550BEB00D7DFEDBC7A.pdf; Supplier: LCSC; Crystal Type: 贴片晶振; Normal temperature Frequency Tolerance: ±10ppm; External load capacitor: 9pF; Frequency Stability(Full temperature range): ±20ppm; Operating Temperature: -40℃~+85℃; Design Item ID: Y_1; Library Name: fly

## Nets
3.3V: C2.1 C4.2 C5.2 C7.1 C10.1 C11.2 C14.2 C20.2 C26.2 C27.1 C30.1 D2.1(A) D3.1(A) D4.1(A) R1.2 R2.2 R4.2 U1.9(VDDA) U1.24(VDD_1) U1.36(VDD_2) U1.48(VDD_3) U2.8(VLOGIC) U2.13(VDD) U3.7(VDD) U3.15(VDD) U3.18(VDD) U5.2(Vout) U6.4(VDD) U7.3(WP#) U7.7(HOLD#) U7.8(VCC) U8.6(VDDIO) U8.8(VDD)
5V: C24.2 C25.2 D1.2(K) J1.1 J1.9 J2.1 J2.5 U4.4(VOUT) U5.3(Vin)
GND: ATN1.2 C1.1 C2.2 C3.2 C4.1 C5.1 C6.2 C7.2 C8.2 C10.2 C11.1 C12.2 C13.2 C14.1 C15.1 C16.1 C17.2 C18.2 C19.1 C20.1 C23.1 C24.1 C25.1 C26.1 C27.2 C30.2 J1.4 J1.12 J2.4 J2.8 J2.12 Q1.3(S) Q2.3(S) Q3.3(S) Q4.3(S) R3.2 R7.1 R11.1 R12.1 R16.1 R17.1 R18.1 U1.8(VSSA) U1.23(VSS_1) U1.35(VSS_2) U1.44(BOOT0) U1.47(VSS_3) U2.1(CLKIN) U2.9(AD0) U2.11(FSYNC) U2.18(GND) U3.8(VSS) U3.14(VSS) U3.17(VSS) U3.20(VSS) U4.2(GND) U5.1(GND) U6.3(GND) U7.4(GND) U8.1(GND) U8.7(GND) VIN1.1(2) Y1.2 Y1.4
VBAT: C21.2 C22.2 C23.2 C28.2 C29.2 D5.1 D6.1 D7.1 D8.1 F1.2 L4.1 M1.1 M2.1 M3.1 M4.1
CE: U1.32(PA11) U3.1(CE)
CS1: U1.25(PB12) U3.2(CSN)
CS2: U1.29(PA8) U7.1(CS#)
LED1: D7.2 U1.38(PA15)
LED2: D8.2 U1.20(PB2)
LED3: D6.2 U1.10(PA0_WKUP)
LED4: D5.2 U1.11(PA1)
MISO: U1.27(PB14) U3.5(MISO) U7.2(DO)
MOSI: U1.28(PB15) U3.4(MOSI) U7.5(DI)
NRF_IRQ: U1.33(PA12) U3.6(IRQ)
OSC_IN: C18.1 R6.1 U1.5(PD0-OSC_IN) X1.1(OSC1)
OSC_OUT: C19.2 R6.2 U1.6(PD1-OSC_OUT) X1.2(OSC2)
PA4: J1.8 U1.14(PA4)
PA5: J1.7 U1.15(PA5)
PA6: J1.6 U1.16(PA6)
PA7: J1.5 U1.17(PA7)
PB3: J2.9 U1.39(PB3)
PB4: J2.10 U1.40(PB4)
PB5: J2.11 U1.41(PB5)
PC13: R8.1 U1.2(PC13)
PWM1: R9.2 U1.45(PB8)
PWM2: R10.2 U1.19(PB1)
PWM3: R14.2 U1.46(PB9)
PWM4: R15.2 U1.18(PB0)
RST: C6.1 R4.1 U1.7(NRST)
RXD1: J2.3 U1.31(PA10)
RXD2: J1.10 U1.13(PA3) U6.2(TXD)
RXD3: J1.2 U1.22(PB11)
SCK: U1.26(PB13) U3.3(SCK) U7.6(CLK)
SCL: R2.1 U1.42(PB6) U2.23(SCL) U8.4(SCK)
SDA: R1.1 U1.43(PB7) U2.24(SDA) U8.3(SDA)
SWCLK: J2.7 U1.37(PA14)
SWDIO: J2.6 U1.34(PA13)
TXD1: J2.2 U1.30(PA9)
TXD2: J1.11 U1.12(PA2) U6.1(RXD)
TXD3: J1.3 U1.21(PB10)
$1N42: C15.2 U2.10(REGOUT)
$1N81: R3.1 U3.16(IREF)
$1N82: C1.2 U3.19(DVDD)
$1N85: C16.2 R5.1 U3.9(XC2) Y1.1
$1N86: C17.1 R5.2 U3.10(XC1) Y1.3
$1N88: C28.1 M3.2 Q3.2(D)
$1N89: C29.1 M4.2 Q4.2(D)
$1N90: C22.1 M2.2 Q2.2(D)
$1N91: C21.1 M1.2 Q1.2(D)
$1N122: L1.1 L2.2 U3.13(ANT2)
$1N123: L2.1 L3.2 U3.12(ANT1)
$1N124: C12.1 C13.1 L3.1 U3.11(VDD_PA)
$1N1531: Q1.1(G) R9.1 R11.2
$1N1536: C3.1 U2.20(CPOUT)
$1N1557: C9.2 L1.2
$1N1588: Q2.1(G) R10.1 R12.2
$1N1589: Q3.1(G) R14.1 R16.2
$1N1590: Q4.1(G) R15.1 R17.2
$1N24218: D2.2(K) R7.2
$1N24219: D3.2(K) R8.2
$1N25042: R18.2 U8.5(SDO)
$1N25237: R13.1 U6.5(LED)
$1N45485: D1.1(A) L4.2 U4.1(SW)
$1N71016: D4.2(K) R13.2
$1N71133: KG1.3 VIN1.2(1)
Net-(ATN1-1): ATN1.1 C8.1 C9.1
Net-(F1-1): F1.1 KG1.2

Not connected (* = marked no-connect by the designer): KG1 1*; U1 1(VBAT)* 3(PC14-OSC32_IN)* 4(PC15-OSC32_OUT)*; U2 2(NC)* 3(NC)* 4(NC)* 5(NC)* 6(AX_DA)* 7(AX_CL)* 12(INT)* 14(NC)* 15(NC)* 16(NC)* 17(NC)* 19(RESV)* 21(RESV)* 22(CLKOUT)*; U4 3(NC)* 5(NC)*; U8 2(CSB)*

## Notes on the sheet
- STM32最小系统电路
- MPU6050 6轴陀螺仪
- NRF24L01 2.4G通讯模块
- LED
- 电源-开关-升压-降压
- 电机
- 红
- 黑
- 前左电机
- 前右电机
- 指示灯
- 蓝牙
- Flash
- 前
- 后
- 扩展接口
- 气压计
- 后左电机
- 后右电机
